# EAGLE design Air humidity sensor v1.9 (EAGLE 6.3)
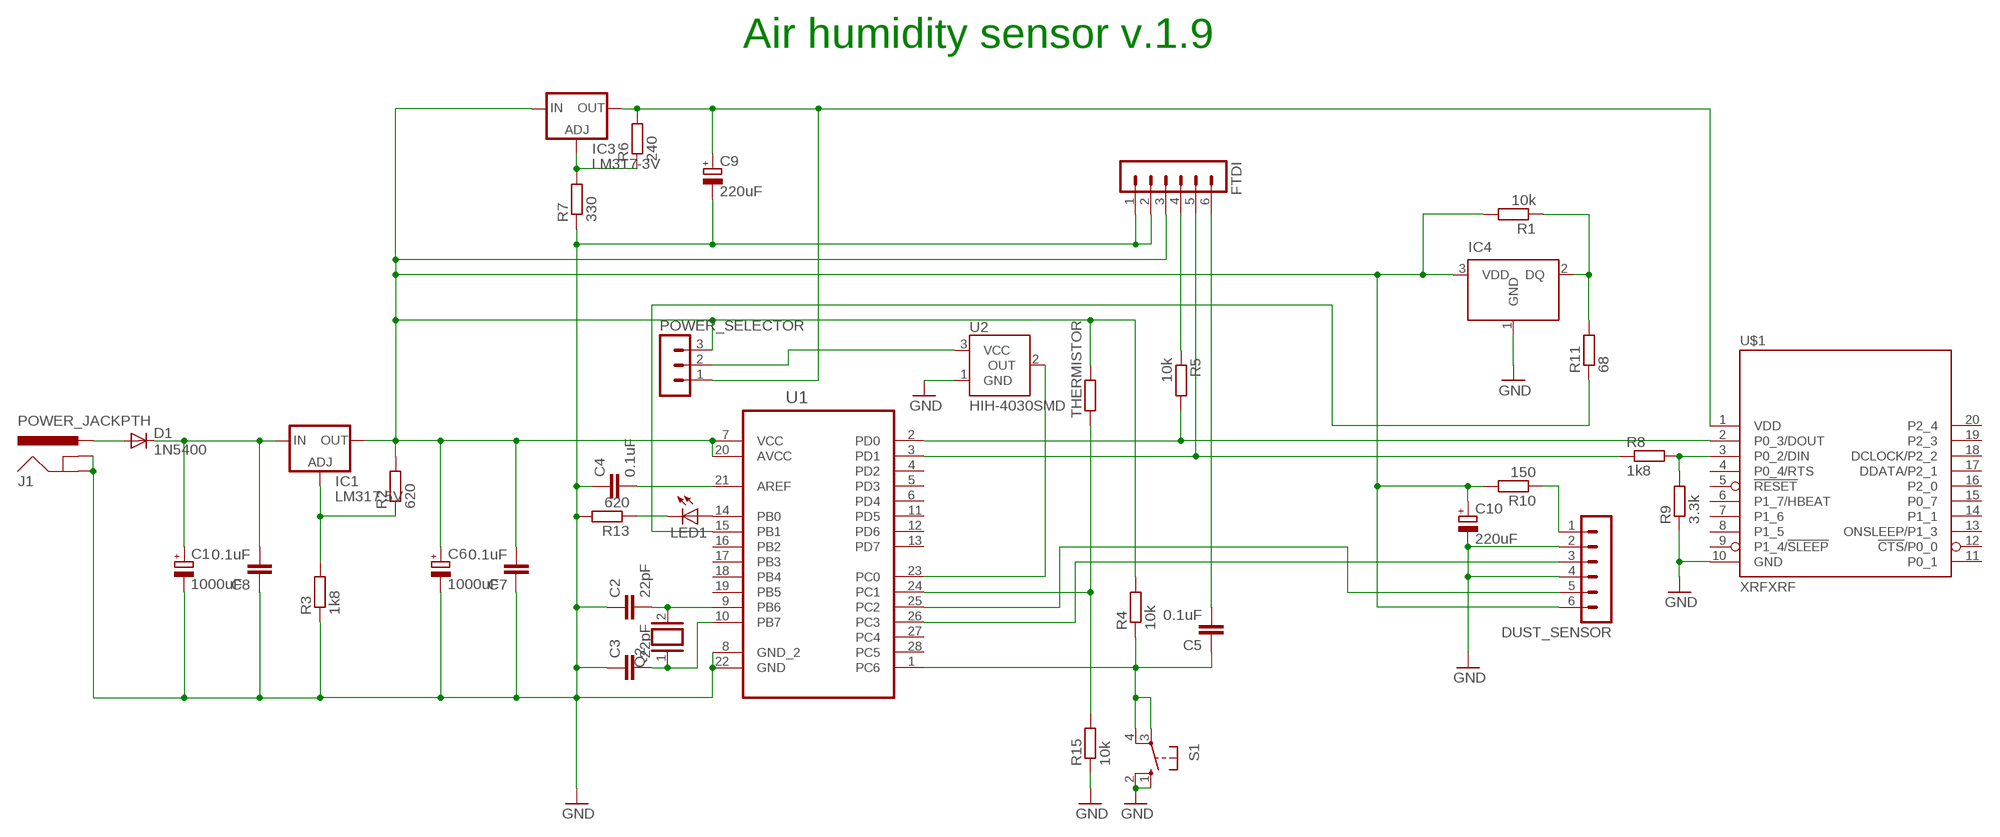
[diagram p0: schematic, sheet 1]

## Parts
C1  1000uF  CPOL-EUE5-10.5  [E5-10,5]
C2  22pF  C-EU025-025X050  [C025-025X050]
C3  22pF  C-EU025-025X050  [C025-025X050]
C4  0.1uF  C-EU075-032X103  [C075-032X103]
C5  0.1uF  C-EU050-025X075  [C050-025X075]
C6  1000uF  CPOL-EUE5-10.5  [E5-10,5]
C7  0.1uF  C-EU050-025X075  [C050-025X075]
C8  0.1uF  C-EU050-025X075  [C050-025X075]
C9  220uF  CPOL-EUE3.5-8  [E3,5-8]
C10  220uF  CPOL-EUE5-10.5  [E5-10,5]
D1  1N5400  [DO201-15]
DUST_SENSOR  MA06-1  [MA06-1]
FTDI  MA06-1  [MA06-1]
IC1  LM317 5V  LM317TS  [317TS]
IC3  LM317-3V  LM317TS  [317TS]
IC4  DS1820  [TO-92]
J1  POWER_JACKPTH  [POWER_JACK_PTH]
LED1  LED3MM  [LED3MM]
POWER_SELECTOR  MA03-1  [MA03-1]
Q2  XTAL/S  [QS]
R1  10k  R-EU_0207/5V  [0207/5V]
R2  620  R-EU_0207/5V  [0207/5V]
R3  1k8  R-EU_0207/5V  [0207/5V]
R4  10k  R-EU_0207/5V  [0207/5V]
R5  10k  R-EU_0207/5V  [0207/5V]
R6  240  R-EU_0207/5V  [0207/5V]
R7  330  R-EU_0207/5V  [0207/5V]
R8  1k8  R-EU_0207/12  [0207/12]
R9  3.3k  R-EU_0207/12  [0207/12]
R10  150  R-EU_0207/5V  [0207/5V]
R11  68  R-EU_0207/12  [0207/12]
R13  620  R-EU_0207/12  [0207/12]
R15  10k  R-EU_0207/5V  [0207/5V]
S1  10-XX  [B3F-10XX]
THERMISTOR  R-EU_0207/5V  [0207/5V]
U1  ATMEGA328P-PU  [DIP254P762X457-28]
U2  HIH-4030SMD  [HIH-4030]
U$1  XRFXRF  [XRF]

## Nets
GND: C1.- C2.1 C3.1 C4.1 C6.- C7.1 C8.1 C9.- C10.- DUST_SENSOR.2 DUST_SENSOR.4 FTDI.1 FTDI.2 IC4.1(GND) J1.GND J1.GNDBREAK R3.1 R7.1 R9.1 R13.2 R15.1 S1.1(S) S1.2(S1) U1.8(GND_2) U1.22(GND) U2.1(GND) U$1.10(GND)
LM317-5V: IC1.1(ADJ) R2.1 R3.2
N$1: C4.2 U1.21(AREF)
N$2: C5.2 FTDI.6
N$3: DUST_SENSOR.5 U1.25(PC2)
N$4: DUST_SENSOR.3 U1.26(PC3)
N$5: R15.2 THERMISTOR.1 U1.24(PC1)
N$6: C9.+ IC3.2(OUT) POWER_SELECTOR.1 R6.2 U$1.1(VDD)
N$7: C6.+ C7.2 C10.+ DUST_SENSOR.6 FTDI.3 IC1.2(OUT) IC3.3(IN) IC4.3(VDD) POWER_SELECTOR.3 R1.2 R2.2 R4.2 R10.2 THERMISTOR.2 U1.7(VCC) U1.20(AVCC)
N$8: D1.A J1.PWR
N$9: U1.23(PC0) U2.2(OUT)
N$10: C1.+ C8.2 D1.C IC1.3(IN)
N$13: C2.2 Q2.2 U1.9(PB6)
N$14: C3.2 Q2.1 U1.10(PB7)
N$15: C5.1 R4.1 S1.3(P) S1.4(P1) U1.1(PC6)
N$19: FTDI.4 R5.1
N$20: R5.2 U1.2(PD0) U$1.2(P0_3/DOUT)
N$21: FTDI.5 R8.1 U1.3(PD1)
N$22: IC3.1(ADJ) R6.1 R7.2
N$24: R8.2 R9.2 U$1.3(P0_2/DIN)
N$25: POWER_SELECTOR.2 U2.3(VCC)
N$26: IC4.2(DQ) R1.1 R11.2
N$27: R11.1 U1.15(PB1)
N$33: DUST_SENSOR.1 R10.1
N$50: LED1.K(C) R13.1
N$69: LED1.A U1.14(PB0)
Unconnected: U1.4(PD2) U1.5(PD3) U1.6(PD4) U1.11(PD5) U1.12(PD6) U1.13(PD7) U1.16(PB2) U1.17(PB3) U1.18(PB4) U1.19(PB5) U1.27(PC4) U1.28(PC5) U$1.4(P0_4/RTS) U$1.5(!RESET) U$1.6(P1_7/HBEAT) U$1.7(P1_6) U$1.8(P1_5) U$1.9(P1_4/!SLEEP) U$1.11(P0_1) U$1.12(!CTS!/P0_0) U$1.13(ONSLEEP/P1_3) U$1.14(P1_1) U$1.15(P0_7) U$1.16(P2_0) U$1.17(DDATA/P2_1) U$1.18(DCLOCK/P2_2) U$1.19(P2_3) U$1.20(P2_4)

## Notes on the sheet
- Air humidity sensor v.1.9

## Library data of the parts
C1 C6 C9 C10 = rcl:CPOL-EU: POLARIZED CAPACITOR, European symbol
C2-C5 C7 C8 = rcl:C-EU: CAPACITOR, European symbol
D1 = diode:1N5400: DIODE standard rectifier, 3 A, 50 V (Motorola)
DUST_SENSOR FTDI = con-lstb:MA06-1: PIN HEADER; OC_FARNELL: unknown; OC_NEWARK: unknown
IC1 IC3 = v-reg:LM317TS: VOLTAGE REGULATOR
IC4 = DS1820:DS1820: DS1820 - 1-Wire Digital Thermometer
J1 = SparkFun-Connectors:POWER_JACK: Power Jack This is the standard 5.5mm barrel jack for power. The PTH is the most common, proven, reliable, footprint. The Slot footprint only works if the mill layer is transmitted to the PCB fab house so be warned. Spark Fun Electronics SKU : PRT-00119 SMT: CONN-08106 Mating wall wart : TOL-00298 (and others)
LED1 = adafruit:LED: LED OSRAM: - CHIPLED LG R971, LG N971, LY N971, LG Q971, LY Q971, LO R971, LY R971 LH N974, LH R974 LS Q976, LO Q976, LY Q976 LO Q996 - Hyper CHIPLED LW Q18S LB Q993, LB Q99A, LB R99A - SideLED LS A670, LO A670, LY A670, LG A670, LP A670 LB A673, LV A673, LT A673, LW A673 LH A674 LY A675 LS A676, LA A676, LO A676, LY A676, LW A676 LS A679, LY A679, LG A679 - Hyper Micro SIDELED® LS Y876, LA Y876, LO Y876, LY Y876 LT Y87S - SmartLED LW L88C, LW L88S LB L89C, LB L89S, LG L890 LS L89K, LO L89K, LY L89K LS L896, LA L896, LO L896, LY L896 - TOPLED LS T670, LO T670, LY T670, LG T670, LP T670 LSG T670, LSP T670, LSY T670, LOP T670, LYG T670 LG T671, LOG T671, LSG T671 LB T673, LV T673, LT T673, LW T673 LH T674 LS T676, LA T676, LO T676, LY T676, LB T676, LH T676, LSB T676, LW T676 LB T67C, LV T67C, LT T67C, LS T67K, LO T67K, LY T67K, LW E67C LS E67B, LA E67B, LO E67B, LY E67B, LB E67C, LV E67C, LT E67C LW T67C LS T679, LY T679, LG T679 LS T770, LO T770, LY T770, LG T770, LP T770 LB T773, LV T773, LT T773, LW T773 LH T774 LS E675, LA E675, LY E675, LS T675 LS T776, LA T776, LO T776, LY T776, LB T776 LHGB T686 LT T68C, LB T68C - Hyper Mini TOPLED® LB M676 - Mini TOPLED Santana® LG M470 LS M47K, LO M47K, LY M47K Source: http://www.osram.convergy.de/
POWER_SELECTOR = con-lstb:MA03-1: PIN HEADER; OC_FARNELL: unknown; OC_NEWARK: unknown
Q2 = special:XTAL/S: CRYSTAL
R1-R11 R13 R15 THERMISTOR = rcl:R-EU_: RESISTOR, European symbol
S1 = switch-omron:10-XX: OMRON SWITCH; MPN: B3F-1000; OC_FARNELL: 176432; OC_NEWARK: 36M3542
U1 = Atmega328p-PU:ATMEGA328P-PU: 8-bit Microcontroller with In-System Programmable Flash; MPN: ATMEGA328P-PU; OC_FARNELL: 1715487; OC_NEWARK: 15R0268; PACKAGE: PDIP-28; SUPPLIER: Atmel
U2 = SparkFun-Sensors VG:HIH-4030: Humidity Sensor
U$1 = Ciseco Footprints:XRF: XRF Wireless UART Serial Data Module. www.ciseco.co.uk

## Board
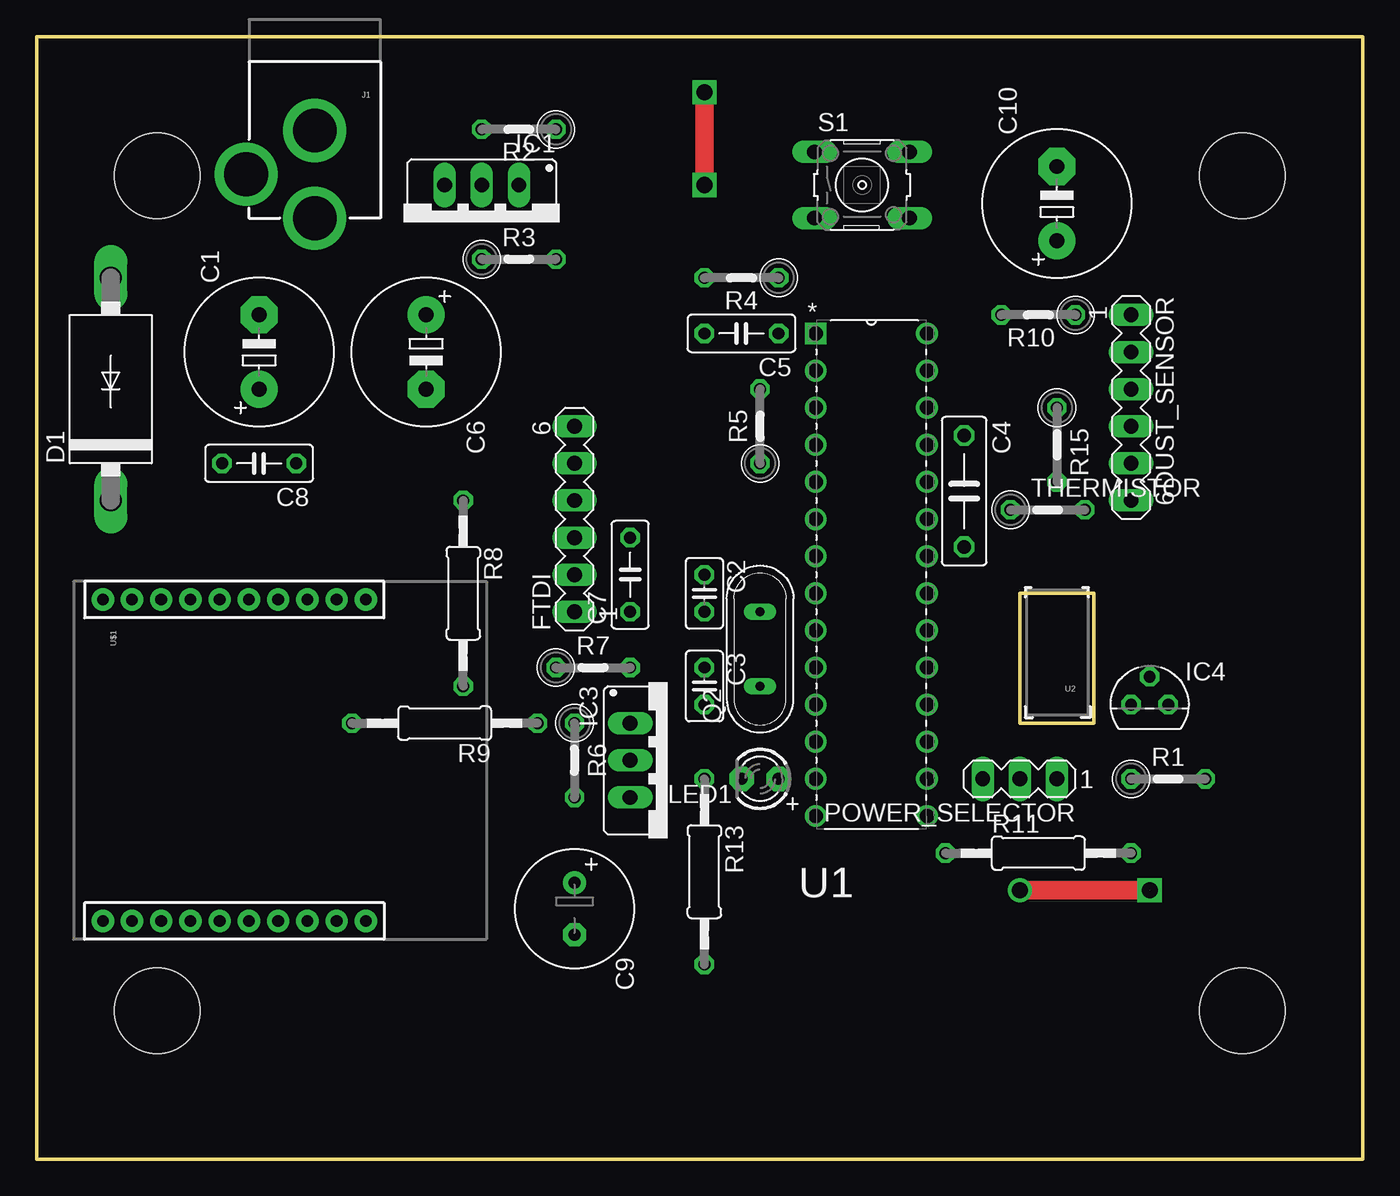
[diagram p1: board, top side]
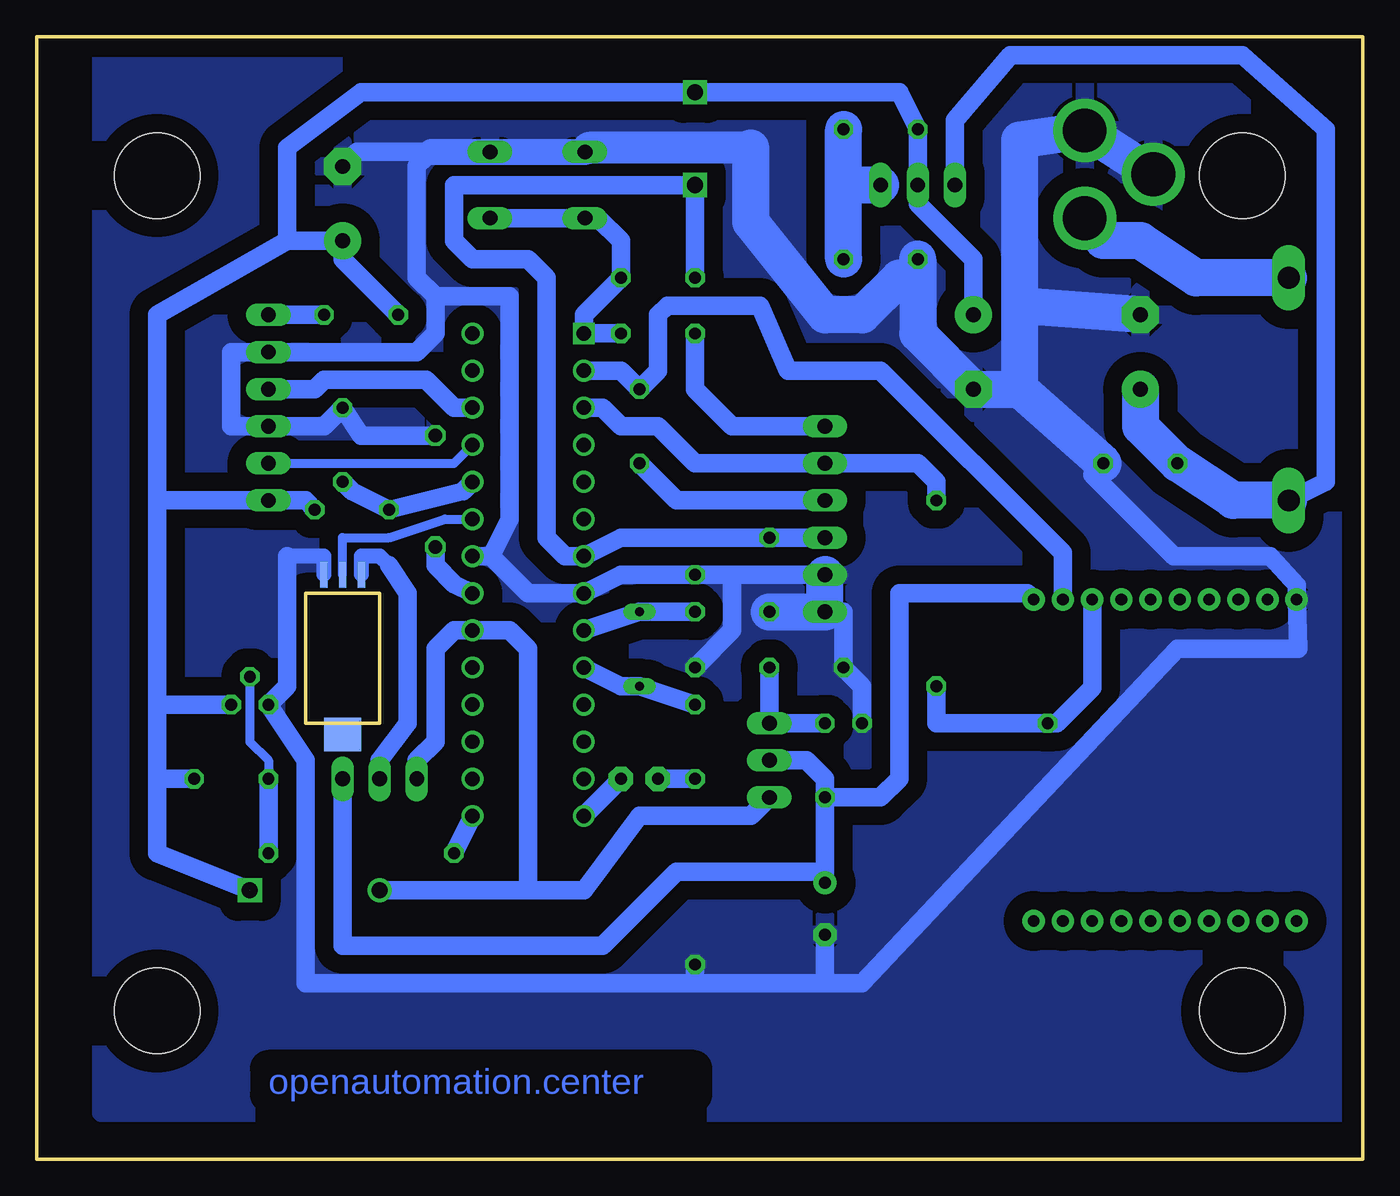
[diagram p2: board, bottom side, seen from below]

Size 90.81 x 76.84 mm. Coordinates in mm from the lower left corner, seen from the top.
Outline: 0,0 0,76.84 90.81,76.84 90.81,0 0,0
Outline: 67.31,38.73 72.39,38.73 72.39,29.85 67.31,29.85 67.31,38.73
Copper layers (1*16): Top 0.035mm / dielectric 1.5mm / Bottom 0.035mm
Design rules "default *": minimum track width 10mil, minimum drill 24mil, track to track 12mil, track to pad 12mil, pad to pad 12mil, via to via 12mil, smd to smd 12mil, copper to edge 40mil, drill to drill 8mil, minimum pad ring 10mil, minimum via ring 8mil, stop-mask expansion 4mil, vias tented up to drill 0mil, thermal gap 10mil
Holes 5.84 mm at 8.26,10.16 82.55,10.16 82.55,67.31 8.26,67.31

### Footprints (pad centres in the part's own frame; a part is rotated, then mirrored left to right if it is on the bottom)
E5-10,5 = drill 1.016 pad 2.54: + -2.54,0 | drill 1.016 pad 2.54 octagon: - 2.54,0
C025-025X050 = drill 0.813 octagon: 1 -1.27,0; 2 1.27,0
C075-032X103 = drill 0.914 octagon: 1 -3.81,0; 2 3.81,0
C050-025X075 = drill 0.813 octagon: 1 -2.54,0; 2 2.54,0
E3,5-8 = drill 0.813 pad 1.6: + -1.778,0 | drill 0.813 pad 1.6 octagon: - 1.778,0
DO201-15 = drill 1.499 long: A 7.62,0; C -7.62,0
MA06-1 = drill 1.016 long: 1 -6.35,0; 2 -3.81,0; 3 -1.27,0; 4 1.27,0; 5 3.81,0; 6 6.35,0
317TS = drill 1.016 long: 1 -2.54,-2.54; 2 0,-2.54; 3 2.54,-2.54
TO-92 = drill 0.813 pad 1.27 octagon: 1 -1.27,0; 2 0,1.905; 3 1.27,0
POWER_JACK_PTH = drill 2.997 pad 4.318: GND 0,7.7; GNDBREAK 4.7,10.7; PWR 0,13.7
LED3MM = drill 0.813 pad 1.676 octagon: A -1.27,0; K 1.27,0
MA03-1 = drill 1.016 long: 1 -2.54,0; 2 0,0; 3 2.54,0
QS = drill 0.61 long: 1 -2.54,0; 2 2.54,0
0207/5V = drill 0.813 octagon: 1 -2.54,0; 2 2.54,0
0207/12 = drill 0.813 octagon: 1 -6.35,0; 2 6.35,0
B3F-10XX = drill 1.016 long: 1 -3.251,2.261; 2 3.251,2.261; 3 -3.251,-2.261; 4 3.251,-2.261
DIP254P762X457-28 = drill 0.991 square: 1 -7.62,33.02 | drill 0.991: 2 -7.62,30.48; 3 -7.62,27.94; 4 -7.62,25.4; 5 -7.62,22.86; 6 -7.62,20.32; 7 -7.62,17.78; 8 -7.62,15.24; 9 -7.62,12.7; 10 -7.62,10.16; 11 -7.62,7.62; 12 -7.62,5.08; 13 -7.62,2.54; 14 -7.62,0; 15 0,0; 16 0,2.54; 17 0,5.08; 18 0,7.62; 19 0,10.16; 20 0,12.7; 21 0,15.24; 22 0,17.78; 23 0,20.32; 24 0,22.86; 25 0,25.4; 26 0,27.94; 27 0,30.48; 28 0,33.02
HIH-4030 = smd 0.508 x 1.778 bottom: 1 -1.27,-5.08; 2 0,-5.08; 3 1.27,-5.08 | smd 2.54 x 2.286 bottom: NC 0,5.842
XRF = drill 0.8 pad 1.524: 1 -11,20; 2 -11,18; 3 -11,16; 4 -11,14; 5 -11,12; 6 -11,10; 7 -11,8; 8 -11,6; 9 -11,4; 10 -11,2; 11 11,2; 12 11,4; 13 11,6; 14 11,8; 15 11,10; 16 11,12; 17 11,14; 18 11,16; 19 11,18; 20 11,20

### Placement (x,y rotation side)
C1  15.24,55.25 90 top
C2  45.72,38.73 270 top
C3  45.72,32.39 270 top
C4  63.5,45.72 270 top
C5  48.26,56.52 180 top
C6  26.67,55.25 270 top
C7  40.64,40 90 top
C8  15.24,47.62 180 top
C9  36.83,17.14 270 top
C10  69.85,65.41 90 top
D1  5.08,52.7 90 top
DUST_SENSOR  74.93,51.44 270 top
FTDI  36.83,43.81 90 top
IC1  30.48,64.14 180 top
IC3  43.18,27.31 270 top
IC4  76.2,31.11 0 top
J1  19.05,78.11 180 top
LED1  49.53,26.04 180 top
POWER_SELECTOR  67.31,26.04 180 top
Q2  49.53,34.92 90 top
R1  77.47,26.04 0 top
R2  33.02,70.48 180 top
R3  33.02,61.59 0 top
R4  48.26,60.33 180 top
R5  49.53,50.17 90 top
R6  36.83,27.31 270 top
R7  38.1,33.66 0 top
R8  29.21,38.73 270 top
R9  27.94,29.85 180 top
R10  68.58,57.79 180 top
R11  68.58,20.96 0 top
R13  45.72,19.68 270 top
R15  69.85,48.9 270 top
S1  56.52,66.67 0 top
THERMISTOR  69.22,44.45 0 top
U1  60.96,23.5 0 top
U2  69.85,34.92 180 top
U$1  2.54,27.31 270 top

### Tracks (layer width: path | path; a pad name or v marks a point on that pad's centre or on a via)
GND
  Bottom 1.016: U2.1 71.12,41.28 73.66,41.28
  Bottom 1.27: FTDI.2 43.18,40 | 43.18,40 C2.1 50.8,40 U1.8 57.15,38.73 59.69,41.28 | C3.1 43.18,36.2 43.18,40 | R9.1 34.29,32.39 R7.1 35.56,37.47 C7.1 | C8.1 18.54,46.86 12.95,41.28 6.35,41.28 4.54,39.28 U$1.10 4.45,34.92 12.7,34.92 34.29,12.07 36.83,12.07 | 49.53,69.22 49.81,68.94 S1.1 52.98,69.22 | 59.69,41.28 U1.22 | 59.69,41.28 58.42,43.81 58.42,59.06 63.5,59.06 | C4.1 68.58,49.53 R15.1 71.12,50.17 DUST_SENSOR.4 77.47,50.17 77.47,55.25 DUST_SENSOR.2 64.77,55.25 63.5,56.52 63.5,59.06 | C10.- 68.86,68.94 64.49,68.94 64.14,68.58 | 63.78,68.94 64.14,68.58 | 64.14,68.58 64.77,67.95 64.77,60.33 63.5,59.06 | 73.66,41.28 73.66,32.39 IC4.1 72.39,27.31 72.39,12.07 45.72,12.07 | 45.72,12.07 36.83,12.07 | R13.2 45.72,12.07 | C9.- 36.83,12.07
  Bottom 1.778: S1.1 S1.2 63.78,68.94
  Bottom 2.184: 41.91,69.22 52.98,69.22
  Bottom 2.54: 23.5,58.42 23.5,69.77 J1.GND J1.GNDBREAK | C1.- 23.5,58.42 | C7.1 FTDI.1 FTDI.2 | 23.5,52.7 C8.1 | 23.5,52.7 C6.- 30.48,56.52 30.48,60.33 | 23.5,52.7 23.5,58.42 | R3.1 30.48,60.33 | 30.48,60.33 31.75,60.33 34.29,57.79 36.83,57.79 41.91,64.14 41.91,69.22
  pour Bottom (isolate 1.27): 1.27,75.56 86.36,75.56 86.36,3.18 1.27,3.18
LM317-5V
  Bottom 2.54: R3.2 35.56,66.67 | 35.56,66.67 R2.1 | IC1.1 35.56,66.67
N$1
  Bottom 1.27: C4.2 63.5,40.64 62.23,39.37 U1.21
N$2
  Bottom 1.27: FTDI.6 43.18,50.17 45.72,52.7 C5.2
N$3
  Bottom 0.61: U1.25 62.23,47.62 DUST_SENSOR.5
N$4
  Bottom 1.27: DUST_SENSOR.3 71.75,52.7 71.12,53.34 64.14,53.34 62.23,51.44 U1.26
N$5
  Bottom 1.27: U1.24 61.59,45.72 THERMISTOR.1 69.22,45.72 R15.2
N$6
  Bottom 1.27: IC3.2 38.1,27.31 36.83,26.04 R6.2 | C9.+ 36.83,19.68 | U$1.1 22.97,38.73 31.75,38.73 31.75,26.04 33.02,24.76 R6.2 | R6.2 36.83,19.68 | 36.83,19.68 46.99,19.68 52.07,14.61 69.85,14.61 POWER_SELECTOR.1
N$7  (via drill 1.1)  (1 unrouted)
  Top 1.27: 76.2,18.42 v67.31,18.42 | v45.72,66.67 v45.72,73.03
  Bottom 1.27: R4.2 v45.72,66.67 62.23,66.67 62.23,62.87 60.96,61.59 57.15,61.59 55.88,60.33 55.88,42.55 54.61,41.28 U1.7 50.8,42.55 FTDI.3 C7.2 | IC3.3 41.91,23.5 49.53,23.5 53.34,18.42 57.15,18.42 | C6.+ 26.67,61.59 30.48,65.41 IC1.2 R2.2 31.75,73.03 v45.72,73.03 68.58,73.03 73.66,69.22 73.66,62.87 | 82.55,45.08 82.55,57.79 73.66,62.87 | 82.55,45.08 82.55,31.11 | 82.55,31.11 82.55,26.04 | 82.55,26.04 82.55,20.96 76.2,18.42 | 82.55,45.08 DUST_SENSOR.6 72.39,45.08 THERMISTOR.2 | R10.2 69.85,61.59 C10.+ 73.66,62.87 | POWER_SELECTOR.3 64.77,27.31 63.5,28.57 63.5,34.92 62.23,36.2 U1.20 58.42,36.2 57.15,34.92 57.15,18.42 | R1.2 82.55,26.04 | IC4.3 82.55,31.11 | 57.15,18.42 v67.31,18.42
N$8
  Bottom 2.54: D1.A 11.43,60.33 15.24,62.87 17.78,62.87 17.78,63.14 J1.PWR
N$9
  Bottom 0.61: U2.2 69.85,42.55 66.67,42.55 62.87,43.81 U1.23
N$10
  Bottom 1.27: D1.C 2.54,46.36 2.54,70.48 8.26,75.56 24.13,75.56 27.94,71.12 IC1.3
  Bottom 2.54: D1.C 8.89,45.08 C8.2 15.24,50.17 C1.+
N$13
  Bottom 1.27: U1.9 Q2.2 C2.2
N$14
  Bottom 1.27: U1.10 50.8,32.39 Q2.1 C3.2
N$15
  Bottom 1.27: S1.4 S1.3 52.35,64.41 50.8,62.87 R4.1 53.34,57.79 U1.1 C5.1
N$19
  Bottom 1.27: FTDI.4 46.99,45.08 R5.1
N$20
  Bottom 1.27: U1.2 50.8,53.98 R5.2 48.26,53.98 48.26,57.79 47.62,58.42 41.27,58.42 39.37,53.98 33.02,53.98 20.54,41.5 U$1.2
N$21
  Bottom 1.27: U1.3 52.07,51.44 50.8,50.17 48.26,50.17 45.72,47.62 FTDI.5 30.48,47.62 29.21,46.36 R8.1
N$22
  Bottom 1.27: R6.1 IC3.1 R7.2
N$24
  Bottom 1.27: U$1.3 18.54,32.26 20.95,29.85 R9.2 29.21,29.85 R8.2
N$25
  Bottom 1.016: 66.67,40.64 67.31,41.28 68.58,41.28 U2.3
  Bottom 1.27: POWER_SELECTOR.2 67.31,27.31 65.41,29.85 65.41,38.73 66.67,40.64
N$26
  Bottom 0.61: IC4.2 76.2,28.57 74.93,27.31 R1.1
  Bottom 1.27: R11.2 R1.1
N$27
  Bottom 1.27: U1.15 R11.1
N$29  (via drill 1.1)
  other vias: 76.2,18.42
N$33
  Bottom 1.27: R10.1 DUST_SENSOR.1
N$50
  Bottom 1.27: LED1.K R13.1
N$69
  Bottom 1.27: U1.14 LED1.A

### Text on the board
Bottom: openautomation.center